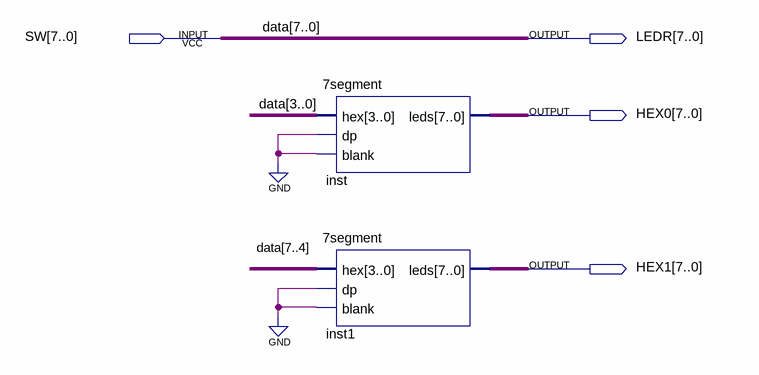
[diagram p0: schematic sheet]
// Quartus schematic LEDtest.bdf as structural Verilog: 2 symbols, 4 pins
module LEDtest (
  input  [7:0] SW,
  output [7:0] LEDR,
  output [7:0] HEX0,
  output [7:0] HEX1
);

  \7segment  inst (.hex(SW[3:0]), .dp(1'b0), .blank(1'b0), .leds(HEX0));
  \7segment  inst1 (.hex(SW[7:4]), .dp(1'b0), .blank(1'b0), .leds(HEX1));

  assign LEDR = SW;

  // Other names for the same wires on the sheet: data[7:0] = SW
endmodule
